# Altium schematic sheet RC Ckt.SchDoc
size A4
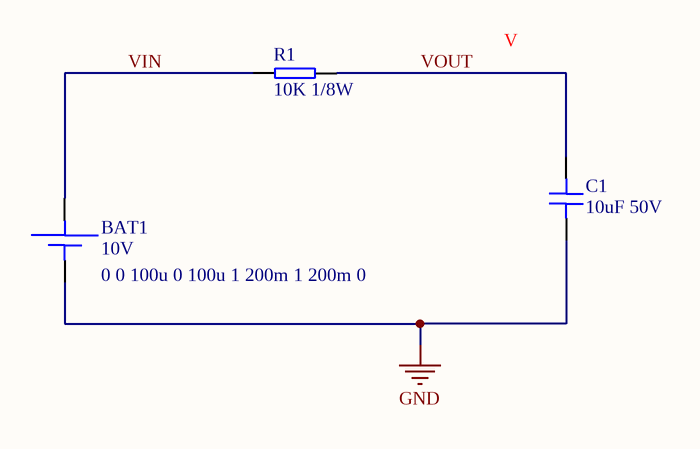
[diagram p0: RC Ckt.SchDoc]

## Parts
BAT1  10V  Time-Value Pairs: 0 0 100u 0 100u 1 200m 1 200m 0  (no BOM)
C1  10uF 50V
R1  10K 1/8W

## Nets
GND: BAT1.2 C1.2
VIN: BAT1.1 R1.1
VOUT: C1.1 R1.2

## Library data of the parts
BAT1 = DC SOURCE: GENERIC DC SOURCE FOR SIMULATION; ASSEMBLY: NONE; AC MAGNITUDE: 0; CODE: NONE; PART NUMBERS: NONE; STATUS: SIMULATION; CATEGORY: POWER SUPPLY; FOOTPRINT: NONE; VALUE: 10V; SHORT DESCRIPTION: DC SOURCE; ORDERING PARAMETERS: NONE; AC PHASE: 0
C1 = CAP 10uF 50V SMD 0805: CERAMIC CAPACITOR 10uF 50V 5% -55C TO 125C SMD 0805; PART NUMBERS: Daagno Altium Library/Components; CODE: 010-000000-00; ORDERING PARAMETERS: 10uF 5% 50V -55C TO 125C; INITIAL VOLTAGE: 0V; ASSEMBLY: SMD; STATUS: PROTOTYPE; CATEGORY: CAPACITOR; VALUE: 10uF; SHORT DESCRIPTION: 10uF 50V
R1 = RES 10K 1/8W SMD 0805: CHIP RESISTOR 10K 1/8W 5% -55C TO 125C SMD 0805; PART NUMBERS: Daagno Altium Library/Components; CODE: 010-000000-00; ORDERING PARAMETERS: 10K 5% 1/8W -55C TO 125C; ASSEMBLY: SMD; STATUS: PROTOTYPE; CATEGORY: RESISTOR; VALUE: 10K; SHORT DESCRIPTION: 10K 1/8W